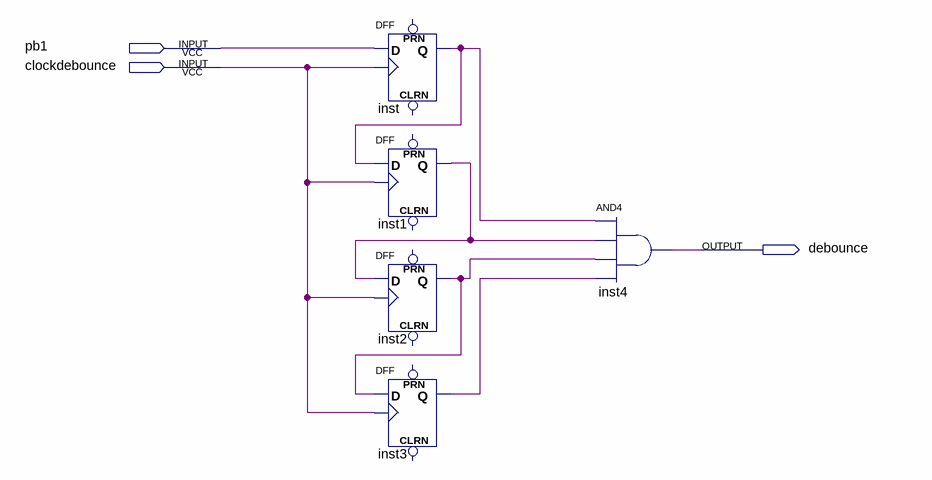
[diagram p0: schematic sheet]
// Quartus schematic Debounce.bdf as structural Verilog: 5 symbols, 3 pins
module Debounce (
  input  pb1,
  input  clockdebounce,
  output debounce
);

  wire inst1_q, inst2_q, inst3_q, inst_q;

  DFF inst (.CLK(clockdebounce), .D(pb1), .Q(inst_q));  // open: CLRN, PRN
  DFF inst1 (.CLK(clockdebounce), .D(inst_q), .Q(inst1_q));  // open: CLRN, PRN
  DFF inst2 (.CLK(clockdebounce), .D(inst1_q), .Q(inst2_q));  // open: CLRN, PRN
  DFF inst3 (.CLK(clockdebounce), .D(inst2_q), .Q(inst3_q));  // open: CLRN, PRN
  and inst4 (debounce, inst_q, inst1_q, inst2_q, inst3_q);
endmodule
